# EAGLE design DCMv3 (EAGLE 9.4.2)
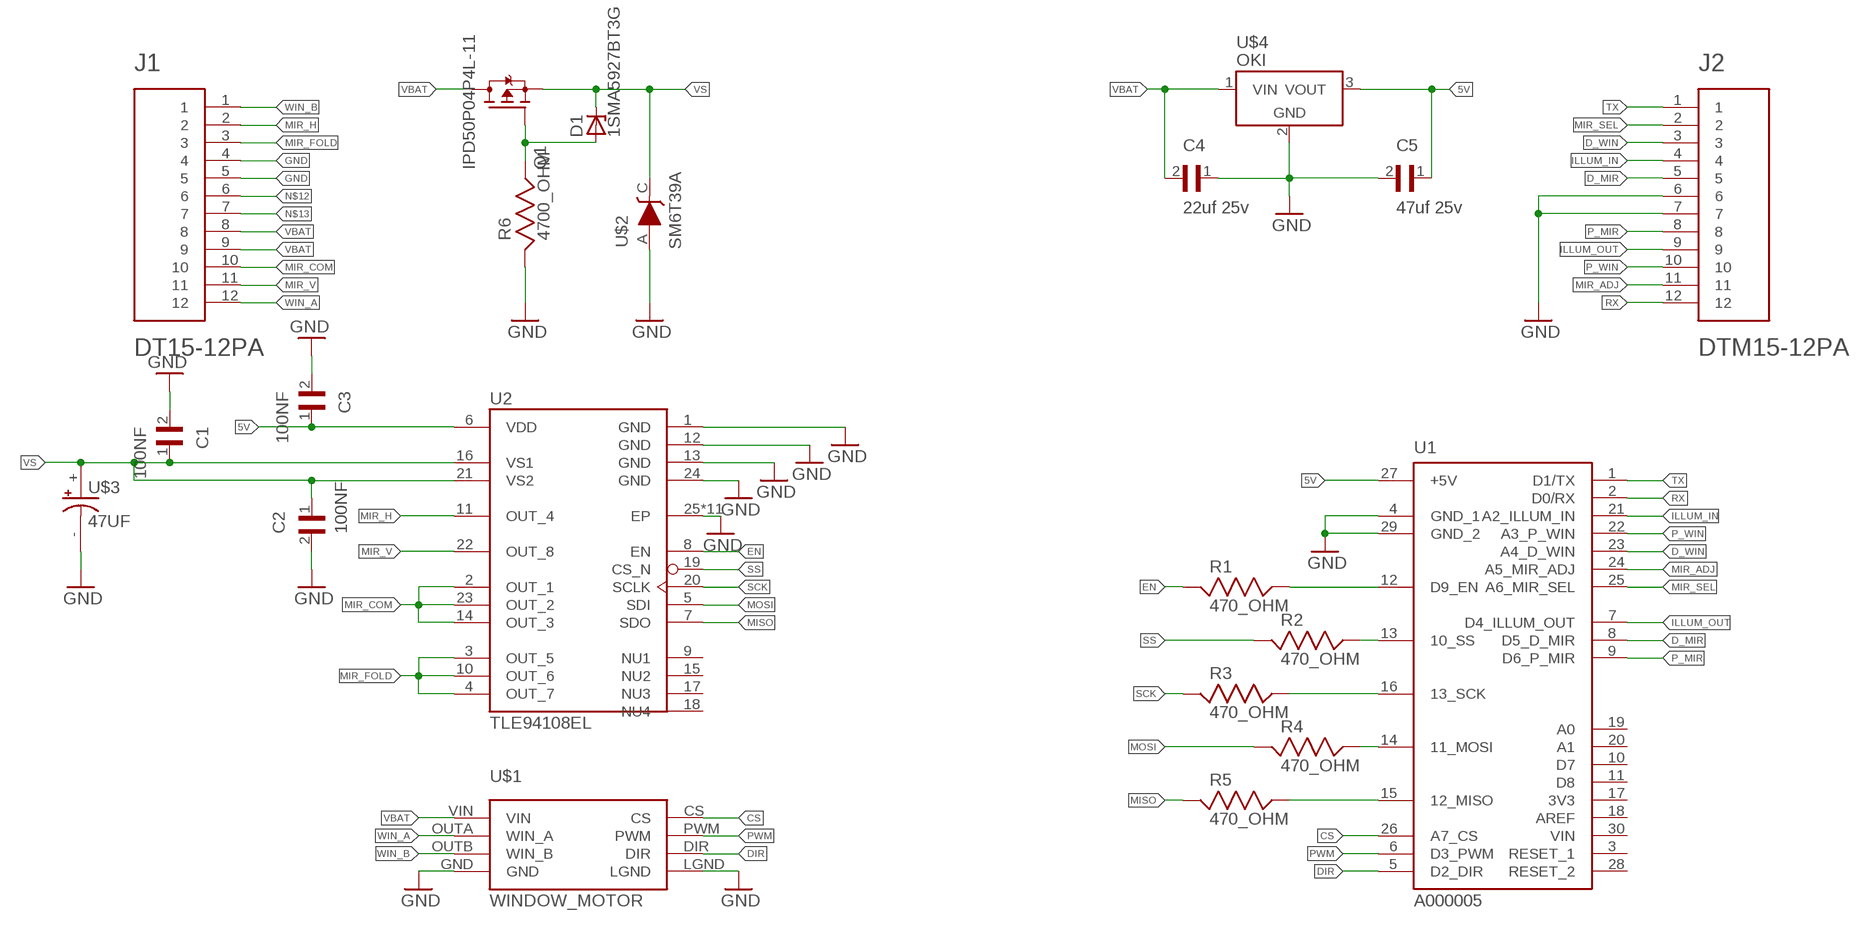
[diagram p0: schematic, sheet 1]

## Parts
C1  100NF  [CAPC3216X110N]
C2  100NF  [CAPC3216X110N]
C3  100NF  [CAPC3216X110N]
C4  22uf 25v  GRM31CC81E226KE11L  [CAP3216X125N]
C5  47uf 25v  GRM31CC81E226KE11L  [CAP3216X125N]
D1  1SMA5927BT3G  [DO214AC]
J1  DT15-12PA  [TE_DT15-12PA]
J2  DTM15-12PA  [TE_DTM15-12PA]
Q1  IPD50P04P4L-11  [DPAK228P998X235-3N]
R1  470_OHM  [RESC3216X65]
R2  470_OHM  [RESC3216X65]
R3  470_OHM  [RESC3216X65]
R4  470_OHM  [RESC3216X65]
R5  470_OHM  [RESC3216X65]
R6  4700_OHM  [RESC3216X70]
U1  A000005  [ARDUINO_A000005]
U2  TLE94108EL  [SOP65P600X170-25N]
U$1  WINDOW_MOTOR  [POLOLU]
U$2  SM6T39A  [SM6T39A]
U$3  47UF  [CAPAE1030X1200]
U$4  OKI  [OKI-78SR-H]

## Nets
5V: C3.1 C5.1 U1.27(+5V) U2.6(VDD) U$4.3(VOUT)
CS: U1.26(A7_CS) U$1.CS
D_MIR: J2.5 U1.8(D5_D_MIR)
D_WIN: J2.3 U1.23(A4_D_WIN)
DIR: U1.5(D2_DIR) U$1.DIR
EN: R1.1 U2.8(EN)
EN_A: R1.2 U1.12(D9_EN)
GATE: D1.A Q1.1(G) R6.2
GND: C1.2 C2.2 C3.2 C4.1 C5.2 J1.4 J1.5 J2.6 J2.7 R6.1 U1.4(GND_1) U1.29(GND_2) U2.1(GND) U2.12(GND) U2.13(GND) U2.24(GND) U2.25(EP) U2.GND1(EP) U2.GND2(EP) U2.GND3(EP) U2.GND4(EP) U2.GND5(EP) U2.GND6(EP) U2.GND7(EP) U2.GND8(EP) U2.GND9(EP) U2.GND(EP) U$1.GND U$1.LGND U$2.A U$3.- U$4.2(GND)
ILLUM_IN: J2.4 U1.21(A2_ILLUM_IN)
ILLUM_OUT: J2.9 U1.7(D4_ILLUM_OUT)
MIR_ADJ: J2.11 U1.24(A5_MIR_ADJ)
MIR_COM: J1.10 U2.2(OUT_1) U2.14(OUT_3) U2.23(OUT_2)
MIR_FOLD: J1.3 U2.3(OUT_5) U2.4(OUT_7) U2.10(OUT_6)
MIR_H: J1.2 U2.11(OUT_4)
MIR_SEL: J2.2 U1.25(A6_MIR_SEL)
MIR_V: J1.11 U2.22(OUT_8)
MISO: R5.1 U2.7(SDO)
MISO_A: R5.2 U1.15(12_MISO)
MOSI: R4.1 U2.5(SDI)
MOSI_A: R4.2 U1.14(11_MOSI)
N$12: J1.6
N$13: J1.7
P_MIR: J2.8 U1.9(D6_P_MIR)
P_WIN: J2.10 U1.22(A3_P_WIN)
PWM: U1.6(D3_PWM) U$1.PWM
RX: J2.12 U1.2(D0/RX)
SCK: R3.1 U2.20(SCLK)
SCK_A: R3.2 U1.16(13_SCK)
SS: R2.1 U2.19(CS_N)
SS_A: R2.2 U1.13(10_SS)
TX: J2.1 U1.1(D1/TX)
VBAT: C4.2 J1.8 J1.9 Q1.2(D) U$1.VIN U$4.1(VIN)
VS: C1.1 C2.1 D1.C Q1.3(S) U2.16(VS1) U2.21(VS2) U$2.C U$3.+
WIN_A: J1.12 U$1.OUTA(WIN_A)
WIN_B: J1.1 U$1.OUTB(WIN_B)
Unconnected: U1.3(RESET_1) U1.10(D7) U1.11(D8) U1.17(3V3) U1.18(AREF) U1.19(A0) U1.20(A1) U1.28(RESET_2) U1.30(VIN) U2.9(NU1) U2.15(NU2) U2.17(NU3) U2.18(NU4)

## Library data of the parts
C1-C3 = C1206C104J5RACTU:100NF: Capacitor: ceramic; MLCC; 100nF; 50V; X7R; ±5%; SMD; 1206; AVAILABILITY: Unavailable; DESCRIPTION: Capacitor: ceramic; 100nF; 50V; X7R; ±5%; SMD; 1206; -55÷125°C; MF: KEMET; MP: C1206C104J5RACTU; PACKAGE: 1206 Kemet; PRICE: None
C4 C5 = GRM31CC81E226KE11L:GRM31CC81E226KE11L: 22UF 25V 10% 1206; AVAILABILITY: Unavailable; DESCRIPTION: Cap Ceramic 22uF 25V X6S 10% SMD 1206 105°C Embossed T/R; MF: Murata Electronics; MP: GRM31CC81E226KE11L; PACKAGE: 1206 Murata; PRICE: None
D1 = 1sma59xx_10:1SMA59*BT3G: 1SMA59xxBT3G Series 1.5 Watt Plastic Surface Mount Zener Voltage Regulators Source: http://www.onsemi.com/pub_link/Collateral/1SMA5913BT3-D.PDF; MF: ON Semiconductor; MPN: 1SMA5927BT3G; OC_FARNELL: 1611250; OC_NEWARK: 45J2419
J1 = DT15-12PA:DT15-12PA: DEUTSCH Automotive; DT RECP ASM; AVAILABILITY: In stock; DESCRIPTION: DEUTSCH Automotive; DT RECP ASM; MF: TE Connectivity; MPN: DT15-12PA; PARTREV: C3; STANDARD: Manufacturer recommendation
J2 = DTM15-12PA:DTM15-12PA: DEUTSCH Automotive; DTM RECP ASM; AVAILABILITY: In stock; DESCRIPTION: DEUTSCH Automotive; DTM RECP ASM; MF: TE Connectivity; MPN: DTM15-12PA; PARTREV: B; STANDARD: Manufacturer recommendation
Q1 = IPD50P04P4L-11:IPD50P04P4L-11: P-Channel 40 V 10.6 mOhm OptiMOS®-P2 Power-Transistor -PG-TO-252-3; AVAILABILITY: Unavailable; DESCRIPTION: P-Channel 40 V 10.6 mOhm OptiMOS®-P2 Power-Transistor -PG-TO-252-3; MF: Infineon Technologies; MP: IPD50P04P4L-11; PACKAGE: TO-252-3 Infineon; PRICE: None
R1-R5 = RC1206FR-13470RL:470_OHM: RC Series 1206 0.25 W 0 O Jumper Surface Mount Thick Film Chip Resistor; AVAILABILITY: Unavailable; DESCRIPTION: Res Thick Film 1206 470 Ohm 1% 1/4W ±100ppm/°C Molded SMD Paper T/R; MF: Yageo; MP: RC1206FR-13470RL; PACKAGE: None; PRICE: None
R6 = ERJ-8ENF4701V:4700_OHM: Res Thick Film 1206 4.7K Ohm 1% 0.25W(1/4W) ±100ppm/C Molded SMD Automotive Punched T/R; AVAILABILITY: Unavailable; DESCRIPTION: Res Thick Film 1206 4.7K Ohm 1% 0.25W_1/4W_ ±100ppm/C Molded SMD Automotive Punched T/R; MF: Panasonic Electronic; MP: ERJ-8ENF4701V; PACKAGE: 1206 Panasonic; PRICE: None
U1 = A000005:A000005: MICRO, ARDUINO NANO 3.0, MINI-B USB, ATmega328, 0.1"DIP, ICSP HDR; AVAILABILITY: Unavailable; DESCRIPTION: MICRO, ARDUINO NANO 3.0, MINI-B USB, ATmega328, 0.1DIP, ICSP HDR; MF: Arduino; MP: A000005; PACKAGE: None; PRICE: None
U2 = TLE94108EL:TLE94108EL: TLE94108EL Protected Eight-Fold Half-Bridge Driver SOP65P600X170-25N
U$1 = Marvelous:WINDOW_MOTOR
U$2 = SM6T39A:SM6T39A
U$3 = EEE-FC1C471AP:47UF: Cap Aluminum Lytic 470uF 16V 20% (10 X 10.2mm) SMD 670mA 1000h 105°C Embossed T/R; AVAILABILITY: Unavailable; DESCRIPTION: Cap Aluminum Lytic 470uF 16V 20% _10 X 10.2mm_ SMD 670mA 1000h 105°C Embossed T/R; MF: Panasonic; MP: EEE-FC1C471AP; PACKAGE: Radial Panasonic; PRICE: None
U$4 = test:OKI

## Board
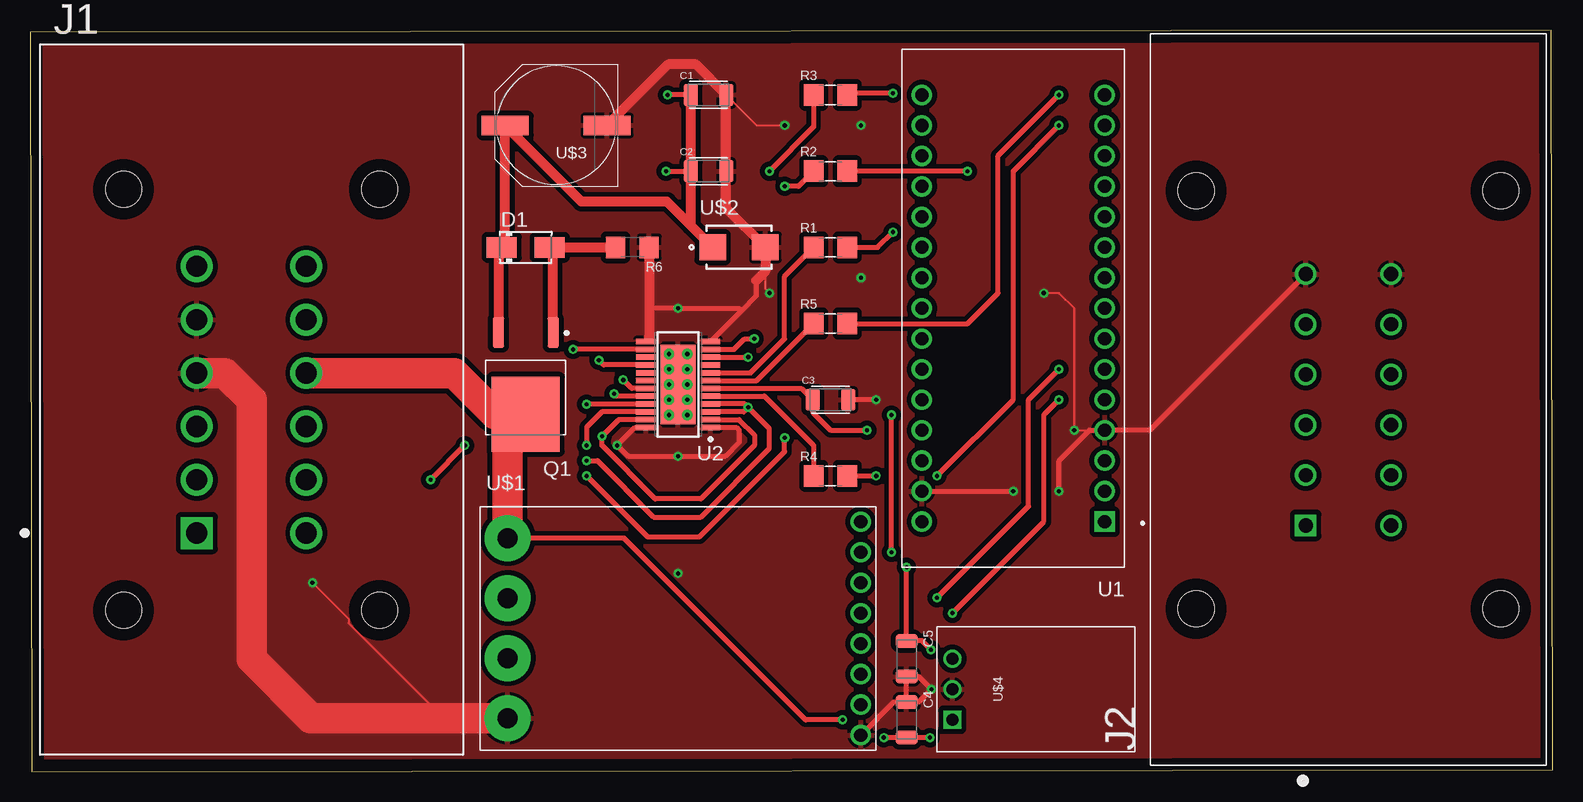
[diagram p1: board, top side]
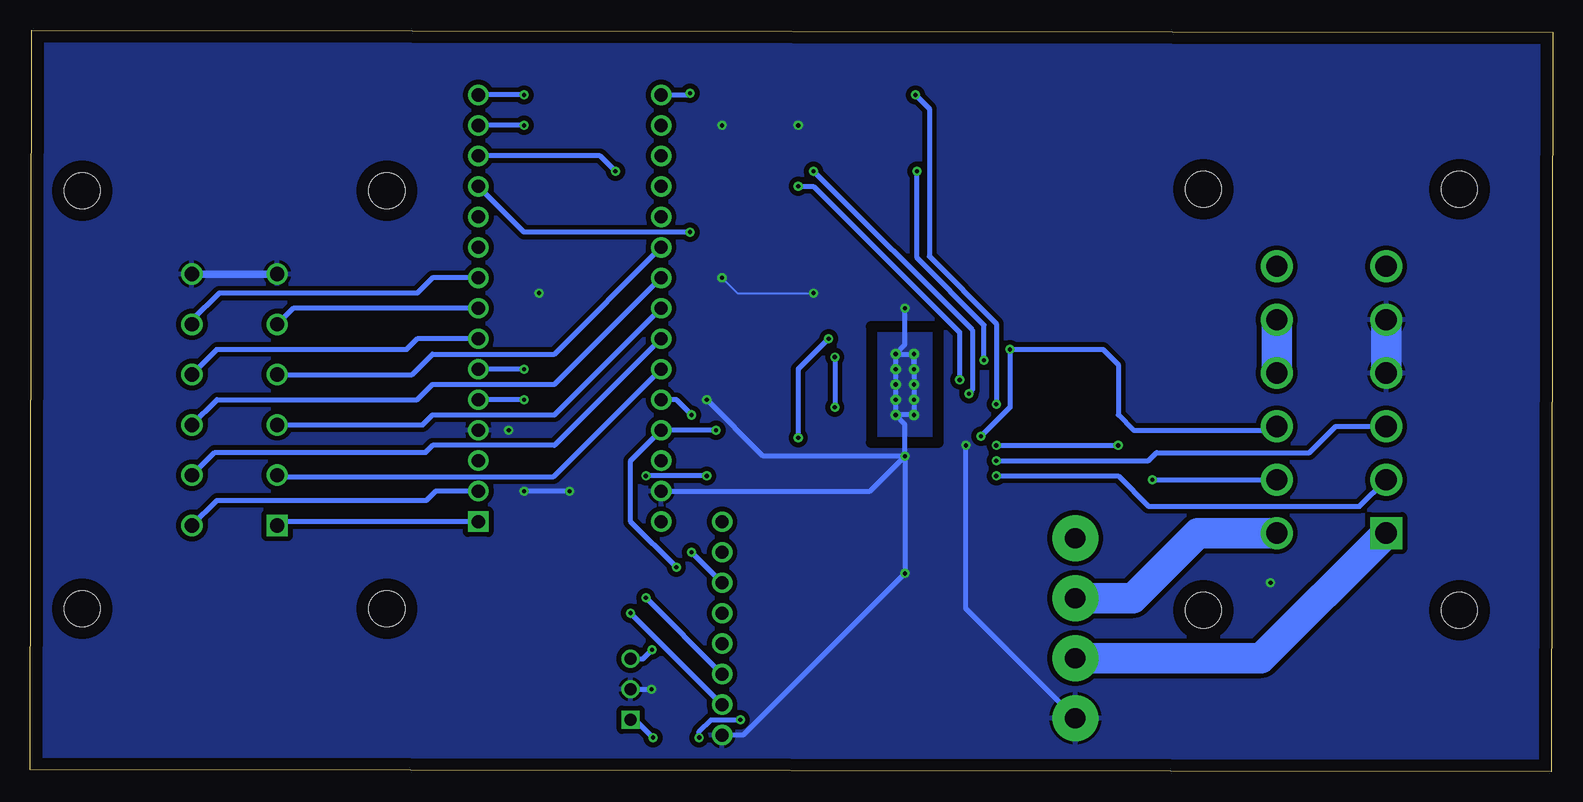
[diagram p2: board, bottom side, seen from below]

Size 126.95 x 61.82 mm. Coordinates in mm from the lower left corner, seen from the top.
Outline: 0.15,0 126.95,0.18 126.8,61.82 0,61.65 0.15,0
Copper layers (1*16): Top 0.035mm / dielectric 1.5mm / Bottom 0.035mm
Design rules "default": minimum track width 6mil, minimum drill 0.35mm, track to track 6mil, track to pad 6mil, pad to pad 6mil, via to via 6mil, smd to smd 6mil, copper to edge 40mil, drill to drill 6mil, minimum pad ring 10mil, minimum via ring 8mil, stop-mask expansion 4mil, vias tented up to drill 0mil, thermal gap 10mil
bRestrict: 4 lines

### Footprints (pad centres in the part's own frame; a part is rotated, then mirrored left to right if it is on the bottom)
CAPC3216X110N = smd 1.16 x 1.82: 1 -1.475,0; 2 1.475,0
CAP3216X125N = smd 1.15 x 1.82: 1 -1.485,0; 2 1.485,0
DO214AC = smd 2.5 x 1.7: A 2,0; C -2,0
TE_DT15-12PA = drill 1.77 square: 1 -4.56,-11.115 | drill 1.77: 2 -4.56,-6.67; 3 -4.56,-2.225; 4 -4.56,2.225; 5 -4.56,6.67; 6 -4.56,11.115; 7 4.56,11.115; 8 4.56,6.67; 9 4.56,2.225; 10 4.56,-2.225; 11 4.56,-6.67; 12 4.56,-11.115 | hole 2.99: -10.67,17.535; 10.67,17.535; 10.67,-17.545; -10.67,-17.545
TE_DTM15-12PA = drill 1.19 square: 1 -10.475,3.555 | drill 1.19: 2 -6.285,3.555; 3 -2.095,3.555; 4 2.095,3.555; 5 6.285,3.555; 6 10.475,3.555; 7 10.475,-3.555; 8 6.285,-3.555; 9 2.095,-3.555; 10 -2.095,-3.555; 11 -6.285,-3.555; 12 -10.475,-3.555 | hole 2.99: -17.41,-12.7; -17.41,12.7; 17.41,12.7; 17.41,-12.7
DPAK228P998X235-3N = smd 0.94 x 2.52: 1 -2.28,-4.34; 3 2.28,-4.34 | smd 5.67 x 6.23: 2 0,2.48
RESC3216X65 = smd 1.6 x 1.8: 1 -1.4,0; 2 1.4,0
RESC3216X70 = smd 1.6 x 1.8: 1 -1.4,0; 2 1.4,0
ARDUINO_A000005 = drill 1.1 pad 1.7 square: 1 -7.62,17.78 | drill 1.1 pad 1.7: 2 -7.62,15.24; 3 -7.62,12.7; 4 -7.62,10.16; 5 -7.62,7.62; 6 -7.62,5.08; 7 -7.62,2.54; 8 -7.62,0; 9 -7.62,-2.54; 10 -7.62,-5.08; 11 -7.62,-7.62; 12 -7.62,-10.16; 13 -7.62,-12.7; 14 -7.62,-15.24; 15 -7.62,-17.78; 16 7.62,-17.78; 17 7.62,-15.24; 18 7.62,-12.7; 19 7.62,-10.16; 20 7.62,-7.62; 21 7.62,-5.08; 22 7.62,-2.54; 23 7.62,0; 24 7.62,2.54; 25 7.62,5.08; 26 7.62,7.62; 27 7.62,10.16; 28 7.62,12.7; 29 7.62,15.24; 30 7.62,17.78
SOP65P600X170-25N = smd 1.6 x 0.457: 1 -2.692,3.581; 2 -2.692,2.921; 3 -2.692,2.286; 4 -2.692,1.626; 5 -2.692,0.965; 6 -2.692,0.33; 7 -2.692,-0.33; 8 -2.692,-0.965; 9 -2.692,-1.626; 10 -2.692,-2.286; 11 -2.692,-2.921; 12 -2.692,-3.581; 13 2.692,-3.581; 14 2.692,-2.921; 15 2.692,-2.286; 16 2.692,-1.626; 17 2.692,-0.965; 18 2.692,-0.33; 19 2.692,0.33; 20 2.692,0.965; 21 2.692,1.626; 22 2.692,2.286; 23 2.692,2.921; 24 2.692,3.581 | smd 2.896 x 6.655: 25 0,0 | drill 0.35: GND -0.762,2.54; GND1 0.762,2.54; GND2 -0.762,1.27; GND3 0.762,1.27; GND4 -0.762,0; GND5 0.762,0; GND6 -0.762,-1.27; GND7 0.762,-1.27; GND8 -0.762,-2.54; GND9 0.762,-2.54
POLOLU = drill 1.1 pad 1.7: 3V3 15.23,6.34; CS 15.23,3.8; DIR 15.23,-6.36; FLT 15.23,1.26; LGND 15.23,-8.9; PWM 15.23,-3.82; SLP 15.23,-1.28; VM 15.23,8.88 | drill 1.7 pad 3.81: GND -14.21,-7.49; OUTA -14.21,2.51; OUTB -14.21,-2.49; VIN -14.21,7.51
SM6T39A = smd 2.2 x 2.15: A 2.2,0; C -2.2,0
CAPAE1030X1200 = smd 3.9 x 1.6: + 4.25,0; - -4.25,0
OKI-78SR-H = drill 1 pad 1.5 square: 1 -2.54,0 | drill 1 pad 1.5: 2 0,0; 3 2.54,0

### Placement (x,y rotation side)
C1  56.57,56.41 0 top
C2  56.57,50.06 0 top
C3  66.73,31.01 0 top
C4  73.08,4.34 270 top
C5  73.08,9.42 270 top
D1  41.33,43.71 0 top
J1  18.47,31.01 0 top
J2  109.91,31.01 90 top
Q1  41.33,32.28 180 top
R1  66.73,43.71 0 top
R2  66.73,50.06 0 top
R3  66.73,56.41 0 top
R4  66.73,24.66 0 top
R5  66.73,37.36 0 top
R6  50.22,43.71 180 top
U1  81.97,38.63 180 top
U2  54.03,32.28 180 top
U$1  54.03,11.96 0 top
U$2  59.11,43.71 0 top
U$3  43.87,53.87 180 top
U$4  76.89,6.88 90 top

### Tracks (layer width: path | path; a pad name or v marks a point on that pad's centre or on a via)
5V  (via drill 0.35)
  Top 0.406: v75.11,10.19 74.35,10.95 73.11,10.95 C5.1 v73.08,17.04 | U2.6 64.31,31.95 C3.1 65.25,29.95 66.73,28.47 v69.77,28.47
  Bottom 0.406: U$4.3 75.87,9.42 v75.11,10.19 | v73.08,17.04 76.89,20.85 76.89,25.93 U1.27 v69.77,28.47
CS  (via drill 0.35)
  Top 0.406: v71.81,18.31 v71.81,29.74
  Bottom 0.406: U$1.CS v71.81,18.31 | U1.26 73.08,31.01 v71.81,29.74
D_MIR
  Bottom 0.406: U1.8 105.02,38.63 J2.5
D_WIN
  Bottom 0.406: J2.3 94.22,28.92 93.4,29.74 83.24,29.74 U1.23
DIR  (via drill 0.35)
  Top 0.406: v76.89,13.23 84.51,20.85 84.51,29.74 v85.78,31.01
  Bottom 0.406: U$1.DIR v76.89,13.23 | v85.78,31.01 U1.5
EN
  Top 0.406: U2.8 60.07,33.25 62.92,36.09 62.92,41.3 R1.1
EN_A  (via drill 0.35)
  Top 0.406: v71.94,44.98 70.67,43.71 R1.2
  Bottom 0.406: U1.12 85.78,44.98 v71.94,44.98
GATE
  Top 0.152: Q1.1 43.58,36.65 | 43.58,43.46 D1.A
  Top 0.813: 43.58,43.46 43.58,36.65 | D1.A R6.2
GND  (via drill 0.35)
  Top 0.152: U1.4 v87.05,28.47 87.05,38.63 85.78,39.9 v84.51,39.9 | v61.65,39.9 61.31,40.24 U$2.A | v23.55,15.77 26.55,12.77 26.55,12.4 34.47,4.47 U$1.GND | C1.2 60.58,53.87 v62.92,53.87
  Top 0.406: C4.1 74.09,5.83 v75.15,6.88 74.09,7.94 C5.2 C4.1 | U2.24 50.44,28.7 v48.95,27.2 49.83,26.31 v54.03,26.31 57.96,26.31 59.11,27.46 59.11,28.47 58.88,28.7 U2.1 | 51.62,36.15 U2.13 | 60.53,40.95 60.53,39.67 59.3,38.44 | 59.3,38.44 U2.12 | J2.6 93.34,28.47 U1.4 88.32,28.47 85.78,25.93 v85.78,23.39 | 51.62,38.63 v54.03,38.63 59.11,38.63 59.3,38.44 | v70.54,31.01 C3.2 | U$1.LGND 72.02,5.83 C4.1 | U1.29 v81.97,23.39
  Top 0.813: R6.1 51.62,38.63 51.62,36.15 | 60.53,40.95 61.31,41.72 U$2.A 58.04,46.98 C2.2 C1.2 55.5,58.95 53.2,58.95 U$3.- | U2.25 U2.GND4
  Top 2.54: U$1.GND 23.42,4.47 18.47,9.42 18.47,31.01 16.24,33.24 J1.4
  Bottom 0.152: v69.27,41.17 68,39.9 v61.65,39.9
  Bottom 0.406: U$4.2 v75.15,6.88 | U$1.GND 48.95,13.6 v48.95,27.2 | v54.03,26.31 65.84,26.31 v70.54,31.01 | U1.29 56.95,23.39 v54.03,26.31 | v54.03,26.31 v54.03,16.54 67.5,3.06 U$1.LGND | v81.97,23.39 v85.78,23.39 | U2.GND9 U2.GND5 | U2.GND U2.GND1 U2.GND3 U2.GND5 | U2.GND8 U2.GND9 | U2.GND9 U2.GND7 U2.GND5 | U2.GND U2.GND2 U2.GND4 U2.GND6 U2.GND8 | v54.03,26.31 54.03,28.98 U2.GND | U2.GND8 54.03,35.59 v54.03,38.63
  Bottom 0.61: J2.7 J2.6
  Bottom 2.54: J1.4 J1.5
  other vias: 69.27,53.87
  pour Top (isolate 0.406): 0.48,61.47 126.59,61.47 126.59,0.36 0.48,0.36
  pour Bottom (isolate 0.61): 0.61,61.47 126.52,61.47 126.52,0.33 0.61,0.33
  pour Bottom (isolate 0.406): 0.61,61.62 126.44,61.62 126.44,0.38 0.61,0.38
ILLUM_IN
  Bottom 0.406: J2.4 95.11,33.11 93.4,34.82 83.24,34.82 U1.21
ILLUM_OUT
  Bottom 0.406: U1.7 94.67,36.09 95.55,35.2 111.36,35.2 J2.9
MIR_ADJ
  Bottom 0.406: U1.24 83.24,27.2 93.4,27.2 93.97,26.63 111.56,26.63 J2.11
MIR_COM  (via drill 0.35)
  Top 0.406: U2.23 49.07,29.36 v47.68,27.96 47.68,27.2 52.12,22.76 55.93,22.76 60.38,27.2 60.38,28.09 59.11,29.36 U2.2 | U2.14 v45.26,35.2
  Bottom 0.406: v47.68,27.96 45.26,30.38 v45.26,35.2 37.52,35.2 36.25,33.93 36.25,29.74 34.98,28.47 23.34,28.47 J1.10
MIR_FOLD  (via drill 0.35)
  Top 0.406: U2.10 v59.87,34.57 | v59.87,30.38 59.49,30 U2.3 | v59.87,30.38 59.59,30.66 U2.4 | v46.41,25.93 47.29,25.93 51.99,21.23 55.93,21.23 61.65,26.95 61.65,28.6 v59.87,30.38
  Bottom 0.406: v59.87,34.57 v59.87,30.38 | J1.3 18.11,28.79 20.3,26.6 33.04,26.6 33.71,25.93 v46.41,25.93
MIR_H  (via drill 0.35)
  Top 0.406: U2.11 58.67,35.2 59.56,36.09 v60.38,36.09 | v46.41,24.66 51.49,19.58 55.8,19.58 62.92,26.7 v62.92,27.84
  Bottom 0.406: v60.38,36.09 62.92,33.55 v62.92,27.84 | v46.41,24.66 36.25,24.66 33.71,22.12 16.13,22.12 J1.2
MIR_SEL
  Bottom 0.406: U1.25 83.3,24.6 106.22,24.6 J2.2
MIR_V  (via drill 0.35)
  Top 0.406: U2.22 47.68,30 46.41,28.73 v46.41,27.2 | v36.25,27.2 v33.39,24.34
  Bottom 0.406: v46.41,27.2 v36.25,27.2 | v33.39,24.34 J1.11
MISO
  Top 0.406: U2.7 60.58,32.61 R5.1
MISO_A  (via drill 0.35)
  Top 0.406: R5.2 78.16,37.36 80.7,39.9 80.7,51.33 v85.78,56.41
  Bottom 0.406: v85.78,56.41 U1.15
MOSI
  Top 0.406: U2.5 61.21,31.32 65.33,27.2 R4.1
MOSI_A  (via drill 0.35)
  Top 0.406: R4.2 v70.54,24.66 | v75.62,24.66 81.97,31.01 81.97,50.06 v85.78,53.87
  Bottom 0.406: v85.78,53.87 U1.14 | v70.54,24.66 v75.62,24.66
P_MIR
  Bottom 0.406: U1.9 93.4,41.17 94.67,39.9 111.18,39.9 113.46,37.62 J2.8
P_WIN
  Bottom 0.406: J2.10 111.37,31.01 94.67,31.01 93.4,32.28 83.24,32.28 U1.22
PWM  (via drill 0.35)
  Top 0.406: v75.62,14.5 83.24,22.12 83.24,31.01 v85.78,33.55
  Bottom 0.406: U$1.PWM v75.62,14.5 | v85.78,33.55 U1.6
RX
  Bottom 0.406: J2.12 111.37,22.63 93.9,22.63 93.14,23.39 U1.2
SCK  (via drill 0.35)
  Top 0.406: U2.20 48.9,31.32 v48.69,31.52 | R3.1 65.33,53.74 v61.65,50.06
  Bottom 0.406: v61.65,50.06 48.41,36.83 48.41,31.8 v48.69,31.52
SCK_A  (via drill 0.35)
  Top 0.406: v71.94,56.54 68.26,56.54 R3.2
  Bottom 0.406: U1.16 72.07,56.41 v71.94,56.54
SS  (via drill 0.35)
  Top 0.406: U2.19 50.17,31.95 v49.45,32.66 | R2.1 64.06,48.79 v62.92,48.79
  Bottom 0.406: v49.45,32.66 49.45,36.6 61.65,48.79 v62.92,48.79
SS_A  (via drill 0.35)
  Top 0.406: v78.16,50.06 R2.2
  Bottom 0.406: v78.16,50.06 79.43,51.33 U1.13
TX
  Bottom 0.406: U1.1 106.04,20.85 J2.1
VBAT  (via drill 0.35)
  Top 0.152: Q1.2 40.12,29.8 39.82,29.5
  Top 0.406: v75.02,2.86 C4.2 v71.17,2.86 | v67.74,4.34 64.67,4.34 49.54,19.47 U$1.VIN
  Top 2.54: U$1.VIN 39.82,29.5 | Q1.2 38.79,29.8 35.35,33.24 J1.9
  Bottom 0.406: U$4.1 76.5,4.34 v75.02,2.86 | v71.17,2.86 71.17,3.37 70.19,4.34 v67.74,4.34
  Bottom 2.54: J1.9 J1.8
VS  (via drill 0.35)
  Top 0.152: D1.C 39.05,43.43
  Top 0.406: U2.16 47.83,33.91 v47.42,34.31 | v53.01,50.06 C2.1 | C1.1 v53.14,56.41 | v46.41,30.63 46.43,30.66 U2.21
  Top 0.813: 39.05,43.43 Q1.3 | D1.C 39.62,44 U$3.+ 45.97,47.52 53.1,47.52 U$2.C 55.09,45.53 C2.1 C1.1
  Bottom 0.406: v47.42,34.31 47.42,37.24 53.01,42.82 v53.01,50.06 | v53.14,56.41 51.99,55.27 51.99,42.95 46.41,37.36 v46.41,30.63
WIN_A
  Bottom 2.54: U$1.OUTA 35.01,14.47 29.58,19.9 J1.12
WIN_B
  Bottom 2.54: J1.1 24.33,9.47 U$1.OUTB